# Altium project Design_Project_20231.PrjPcb
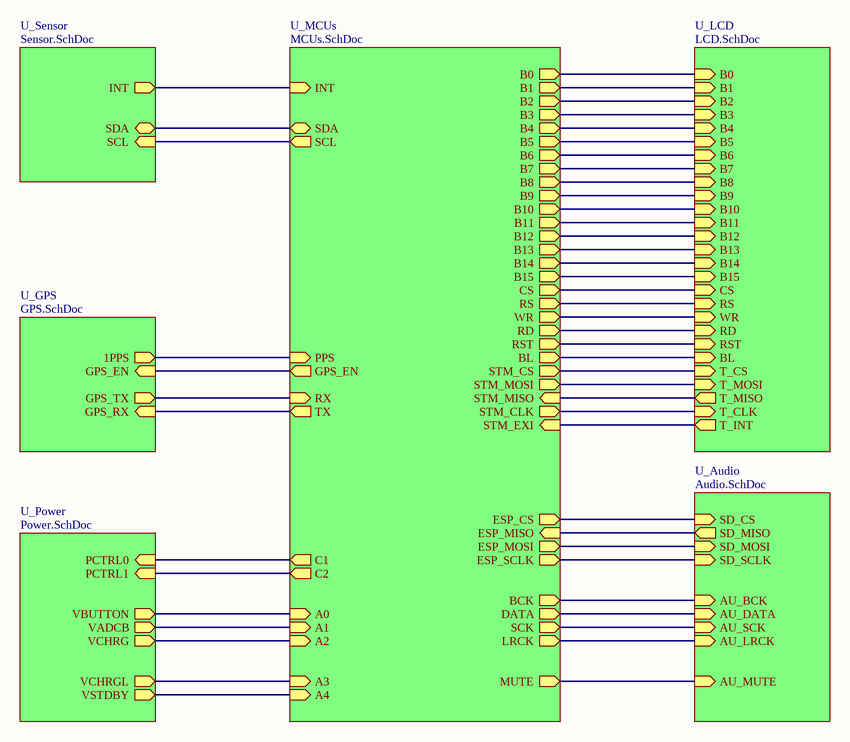
[diagram p0: Block_Diagram.SchDoc]
7 sheets, 134 parts. Net scope: hierarchical (ports join the sheet entries above them; power ports are global).
Board file: DesignProject_00.PcbDoc
Sheets:
  Block_Diagram.SchDoc
    U_MCUs = MCUs.SchDoc
    U_Audio = Audio.SchDoc
    U_GPS = GPS.SchDoc
    U_Power = Power.SchDoc
    U_Sensor = Sensor.SchDoc
    U_LCD = LCD.SchDoc

## Sheet Block_Diagram.SchDoc
size B; Organization: ORGANIZATION; Address1: ADDRESS 1; Address2: ADDRESS 2; Address3: ADDRESS 3; Address4: ADDRESS 4; Revision: -; SheetNumber: 1; SheetTotal: 7; ENG_APP_DATE: --/--/--; DSN_APP_DATE: --/--/--; CHK_APP_DATE: --/--/--

### Sub-sheets
U_Audio = Audio.SchDoc: AU_LRCK (in), SD_MISO (out), SD_CS (in), AU_DATA (in), AU_BCK (in), SD_SCLK (in), AU_SCK (in), AU_MUTE (in), SD_MOSI (in)
U_GPS = GPS.SchDoc: 1PPS (out), GPS_EN (in), GPS_TX (out), GPS_RX (in)
U_LCD = LCD.SchDoc: RST (in), B14 (in), B15 (in), RS (in), B7 (in), B9 (in), B5 (in), CS (in), T_CS (in), T_INT (out), T_MISO (out), B13 (in), B3 (in), B1 (in), T_MOSI (in), RD (in), B0 (in), B2 (in), B4 (in), B6 (in), BL (in), WR (in), B11 (in), T_CLK (in), B12 (in), B10 (in), B8 (in)
U_MCUs = MCUs.SchDoc: B11 (out), A4 (in), B8 (out), B5 (out), B7 (out), B4 (out), B10 (out), A0 (in), A2 (in), B13 (out), B1 (out), B15 (out), A1 (in), B0 (out), B6 (out), B9 (out), A3 (in), B12 (out), B14 (out), B2 (out), B3 (out), SCL (out), C1 (out), RX (in), SDA (bidir), C2 (out), TX (out), RST (out), WR (out), RD (out), CS (out), STM_EXI (in), STM_MISO (in), STM_CS (out), STM_CLK (out), STM_MOSI (out), BL (out), RS (out), PPS (in), ESP_CS (out), ESP_MOSI (out), BCK (out), LRCK (out), SCK (out), DATA (out), ESP_MISO (in), ESP_SCLK (out), INT (in), MUTE (out), GPS_EN (out)
U_Power = Power.SchDoc: VBUTTON (out), VCHRG (out), PCTRL1 (in), PCTRL0 (in), VADCB (out), VSTDBY (out), VCHRGL (out)
U_Sensor = Sensor.SchDoc: SCL (in), INT (out), SDA (bidir)

### Nets
1PPS: sheet U_MCUs/PPS, sheet U_GPS/1PPS
A0: sheet U_MCUs/A0, sheet U_Power/VBUTTON
A1: sheet U_MCUs/A1, sheet U_Power/VADCB
A2: sheet U_MCUs/A2, sheet U_Power/VCHRG
A3: sheet U_MCUs/A3, sheet U_Power/VCHRGL
A4: sheet U_MCUs/A4, sheet U_Power/VSTDBY
A5: sheet U_MCUs/STM_CLK, sheet U_LCD/T_CLK
A6: sheet U_MCUs/STM_MISO, sheet U_LCD/T_MISO
A7: sheet U_MCUs/STM_MOSI, sheet U_LCD/T_MOSI
A8: sheet U_MCUs/RD, sheet U_LCD/RD
A9: sheet U_MCUs/RST, sheet U_LCD/RST
B0: sheet U_MCUs/B0, sheet U_LCD/B0
B1: sheet U_MCUs/B1, sheet U_LCD/B1
B2: sheet U_MCUs/B2, sheet U_LCD/B2
B3: sheet U_MCUs/B3, sheet U_LCD/B3
B4: sheet U_MCUs/B4, sheet U_LCD/B4
B5: sheet U_MCUs/B5, sheet U_LCD/B5
B6: sheet U_MCUs/B6, sheet U_LCD/B6
B7: sheet U_MCUs/B7, sheet U_LCD/B7
B8: sheet U_MCUs/B8, sheet U_LCD/B8
B9: sheet U_MCUs/B9, sheet U_LCD/B9
B10: sheet U_MCUs/B10, sheet U_LCD/B10
B11: sheet U_MCUs/B11, sheet U_LCD/B11
B12: sheet U_MCUs/B12, sheet U_LCD/B12
B13: sheet U_MCUs/B13, sheet U_LCD/B13
B14: sheet U_MCUs/B14, sheet U_LCD/B14
B15: sheet U_MCUs/B15, sheet U_LCD/B15
BCK: sheet U_MCUs/BCK, sheet U_Audio/AU_BCK
C1: sheet U_MCUs/C1, sheet U_Power/PCTRL0
C2: sheet U_MCUs/C2, sheet U_Power/PCTRL1
C4: sheet U_MCUs/STM_CS, sheet U_LCD/T_CS
C5: sheet U_MCUs/STM_EXI, sheet U_LCD/T_INT
C6: sheet U_MCUs/BL, sheet U_LCD/BL
C7: sheet U_MCUs/CS, sheet U_LCD/CS
C8: sheet U_MCUs/RS, sheet U_LCD/RS
C9: sheet U_MCUs/WR, sheet U_LCD/WR
DIN: sheet U_MCUs/DATA, sheet U_Audio/AU_DATA
GPS_RX: sheet U_MCUs/TX, sheet U_GPS/GPS_RX
GPS_TX: sheet U_MCUs/RX, sheet U_GPS/GPS_TX
INT: sheet U_MCUs/INT, sheet U_Sensor/INT
LRCK: sheet U_MCUs/LRCK, sheet U_Audio/AU_LRCK
S_SCL: sheet U_MCUs/SCL, sheet U_Sensor/SCL
S_SDA: sheet U_MCUs/SDA, sheet U_Sensor/SDA
SCK: sheet U_MCUs/SCK, sheet U_Audio/AU_SCK
SD_CS: sheet U_MCUs/ESP_CS, sheet U_Audio/SD_CS
SD_MISO: sheet U_MCUs/ESP_MISO, sheet U_Audio/SD_MISO
SD_MOSI: sheet U_MCUs/ESP_MOSI, sheet U_Audio/SD_MOSI
SD_SCLK: sheet U_MCUs/ESP_SCLK, sheet U_Audio/SD_SCLK
XSMT: sheet U_MCUs/MUTE, sheet U_Audio/AU_MUTE
NetIC1_26: sheet U_MCUs/GPS_EN, sheet U_GPS/GPS_EN

### Notes on the sheet
- DWG. NO.
- REV.
- SHT.
- THIS DOCUMENT AND THE DATA DISCLOSED HEREIN OR HEREWITH IS THE PROPERTY OF ALTIUM LIMITED AND MAY BE FREELY DISTRIBUTED IN WHOLE. NO RIGHTS ARE RESERVED OR EXPRESS OR IMPLIED WARANTEE GIVEN.
- REVISION
- DESCRIPTION
- DATE
- APPROVED
- ENG:
- APPROVALS
- PROJECT
- DSN:
- CHK:
- REFERENCE DOCUMENTS
- PROJECT REVISION:
- TITLE
- DOCUMENT REVISION:
- DESIGN ITEM:
- BOM:
- FAB DWG:
- PCB DWG:
- ASSY DWG:
- SCALE:
- SIZE
- B
- CAGE CODE
- FILE NAME
- DWG NO.
- SHEET
- OF
- REV

## Sheet MCUs.SchDoc
size B; Organization: ORGANIZATION; Address1: ADDRESS 1; Address2: ADDRESS 2; Address3: ADDRESS 3; Address4: ADDRESS 4; Revision: -; SheetNumber: 2; SheetTotal: 7; ENG_APP_DATE: --/--/--; DSN_APP_DATE: --/--/--; CHK_APP_DATE: --/--/--
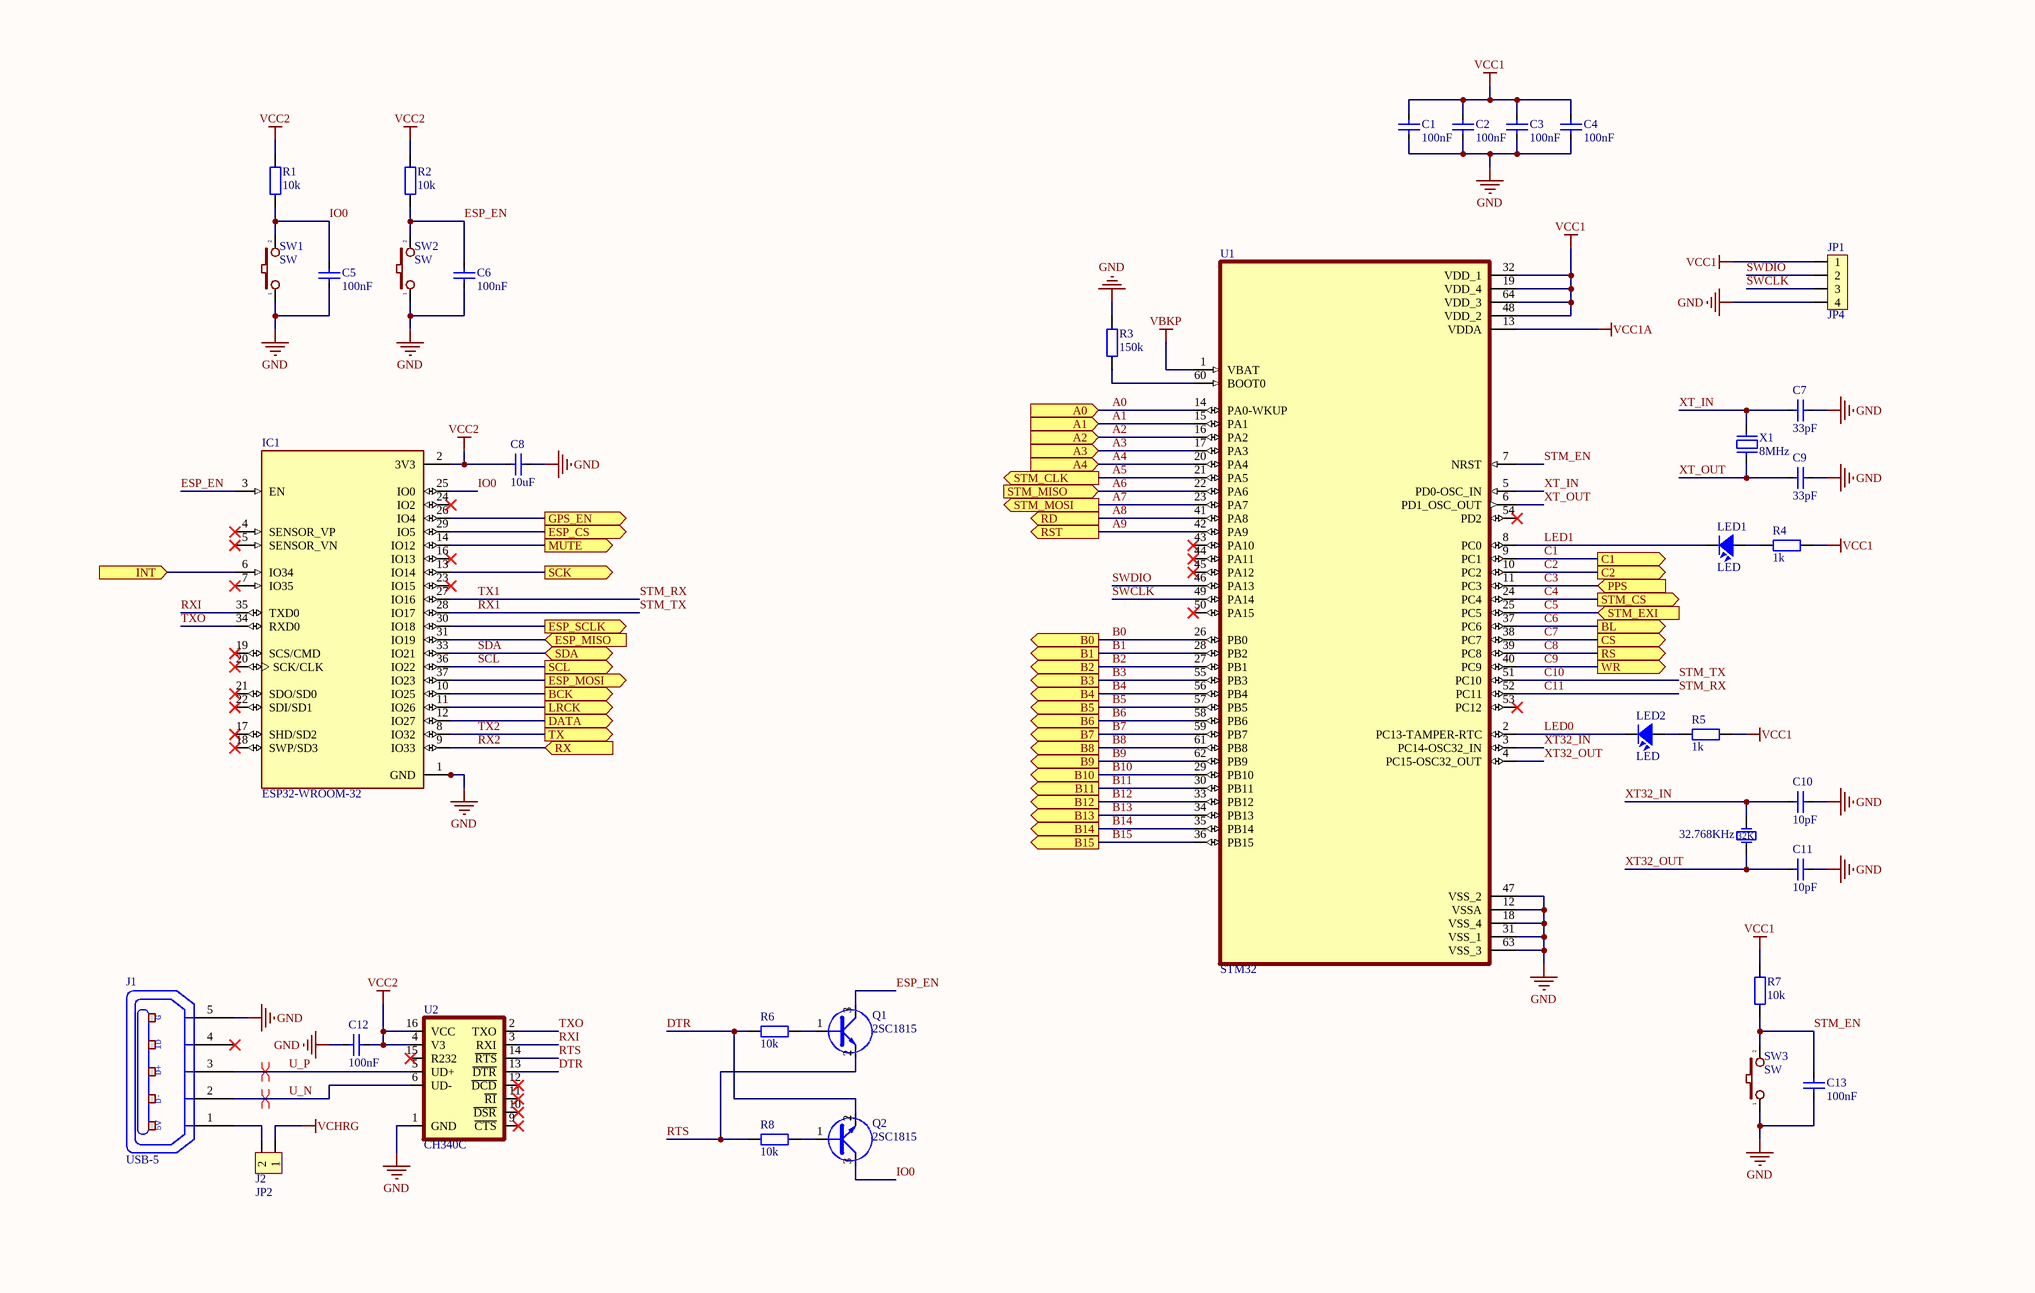
[diagram p1: MCUs.SchDoc]

### Parts
C1  100nF  [CAP_0603]
C2  100nF  [CAP_0603]
C3  100nF  [CAP_0603]
C4  100nF  [CAP_0603]
C5  100nF  [CAP_0603]
C6  100nF  [CAP_0603]
C7  33pF  [CAP_0603]
C8  10uF  [CAP_0603]
C9  33pF  [CAP_0603]
C10  10pF  [CAP_0603]
C11  10pF  [CAP_0603]
C12  100nF  [CAP_0603]
C13  100nF  [CAP_0603]
IC1  ESP32-WROOM-32  [MODULE_ESP32-WROOM-32]
J1  USB-5  [USB-M1]
J2  JP2  [JP2-CLOSED]
JP1  JP4  [JP4-C1T]
LED1  LED  [LED-0805-Red]
LED2  LED  [LED-0805-Red]
Q1  2SC1815  [SOT23D]
Q2  2SC1815  [SOT23D]
R1  10k  [RES-SMD-0603]
R2  10k  [RES-SMD-0603]
R3  150k  [RES-SMD-0603]
R4  1k  [RES-SMD-0603]
R5  1k  [RES-SMD-0603]
R6  10k  [RES-SMD-0603]
R7  10k  [RES-SMD-0603]
R8  10k  [RES-SMD-0603]
SW1  SW  [SW 3x2x4]
SW2  SW  [SW 3x2x4]
SW3  SW  [SW 3x2x4]
U1  STM32  [LQFP 64]
U2  CH340C  [SOP-16]
X1  8MHz  [XT2]
Y1  32.768KHz  [XTAL32K]

### Ports
A0 (in), A1 (in), A2 (in), A3 (in), A4 (in), B0 (out), B1 (out), B2 (out), B3 (out), B4 (out), B5 (out), B6 (out), B7 (out), B8 (out), B9 (out), B10 (out), B11 (out), B12 (out), B13 (out), B14 (out), B15 (out), BCK (out), BL (out), C1 (out), C2 (out), CS (out), DATA (out), ESP_CS (out), ESP_MISO (in), ESP_MOSI (out), ESP_SCLK (out), GPS_EN (out), INT (in), LRCK (out), MUTE (out), PPS (in), RD (out), RS (out), RST (out), RX (in), SCK (out), SCL (out), SDA (bidir), STM_CLK (out), STM_CS (out), STM_EXI (in), STM_MISO (in), STM_MOSI (out), TX (out), WR (out)

### Nets
GND: C1.2 C2.2 C3.2 C4.2 C5.2 C6.2 C7.1 C8.2 C9.1 C10.1 C11.1 C12.1 C13.2 IC1.1(GND) IC1.15(GND) IC1.38(GND) IC1.39_1(GND) IC1.39_2(GND) IC1.39_3(GND) IC1.39_4(GND) IC1.39_5(GND) IC1.39_6(GND) IC1.39_7(GND) IC1.39_8(GND) IC1.39_9(GND) IC1.39_10(GND) IC1.39_11(GND) IC1.39_12(GND) IC1.39_13(GND) IC1.39_14(GND) IC1.39_15(GND) IC1.39_16(GND) IC1.39_17(GND) IC1.39_18(GND) IC1.39_19(GND) IC1.39_20(GND) IC1.39_21(GND) J1.5(P5) JP1.4 R3.1 SW1.1 SW2.1 SW3.1 U1.12(VSSA) U1.18(VSS_4) U1.31(VSS_1) U1.47(VSS_2) U1.63(VSS_3) U2.1(GND)
VBKP: U1.1(VBAT)
VCC1: C1.1 C2.1 C3.1 C4.1 JP1.1 R4.1 R5.1 R7.2 U1.19(VDD_4) U1.32(VDD_1) U1.48(VDD_2) U1.64(VDD_3)
VCC1A: U1.13(VDDA)
VCC2: C8.1 C12.2 IC1.2(3V3) R1.2 R2.2 U2.4(V3) U2.16(VCC)
VCHRG: J2.1
A0: U1.14(PA0-WKUP) ; port A0
A1: U1.15(PA1) ; port A1
A2: U1.16(PA2) ; port A2
A3: U1.17(PA3) ; port A3
A4: U1.20(PA4) ; port A4
A5: U1.21(PA5) ; port STM_CLK
A6: U1.22(PA6) ; port STM_MISO
A7: U1.23(PA7) ; port STM_MOSI
A8: U1.41(PA8) ; port RD
A9: U1.42(PA9) ; port RST
B0: U1.26(PB0) ; port B0
B1: U1.28(PB2) ; port B1
B2: U1.27(PB1) ; port B2
B3: U1.55(PB3) ; port B3
B4: U1.56(PB4) ; port B4
B5: U1.57(PB5) ; port B5
B6: U1.58(PB6) ; port B6
B7: U1.59(PB7) ; port B7
B8: U1.61(PB8) ; port B8
B9: U1.62(PB9) ; port B9
B10: U1.29(PB10) ; port B10
B11: U1.30(PB11) ; port B11
B12: U1.33(PB12) ; port B12
B13: U1.34(PB13) ; port B13
B14: U1.35(PB14) ; port B14
B15: U1.36(PB15) ; port B15
BCK: IC1.10(IO25) ; port BCK
C1: U1.9(PC1) ; port C1
C2: U1.10(PC2) ; port C2
C3: U1.11(PC3) ; port PPS  [project net 1PPS]
C4: U1.24(PC4) ; port STM_CS
C5: U1.25(PC5) ; port STM_EXI
C6: U1.37(PC6) ; port BL
C7: U1.38(PC7) ; port CS
C8: U1.39(PC8) ; port RS
C9: U1.40(PC9) ; port WR
C10: IC1.28(IO17) U1.51(PC10)  [also labelled RX1, STM_TX]
C11: IC1.27(IO16) U1.52(PC11)  [also labelled STM_RX, TX1]
DIN: IC1.12(IO27) ; port DATA
DTR: Q2.2(E) R6.2 U2.13(~{DTR})
ESP_EN: C6.1 IC1.3(EN) Q1.3(C) R2.1 SW2.2
INT: IC1.6(IO34) ; port INT
IO0: C5.1 IC1.25(IO0) Q2.3(C) R1.1 SW1.2
LED0: LED2.2 U1.2(PC13-TAMPER-RTC)
LED1: LED1.2 U1.8(PC0)
LRCK: IC1.11(IO26) ; port LRCK
RTS: Q1.2(E) R8.2 U2.14(~{RTS})
RX2: IC1.9(IO33) ; port RX  [project net GPS_TX]
RXI: IC1.35(TXD0) U2.3(RXI)
SCK: IC1.13(IO14) ; port SCK
SCL: IC1.36(IO22) ; port SCL  [project net S_SCL]
SD_CS: IC1.29(IO5) ; port ESP_CS
SD_MISO: IC1.31(IO19) ; port ESP_MISO
SD_MOSI: IC1.37(IO23) ; port ESP_MOSI
SD_SCLK: IC1.30(IO18) ; port ESP_SCLK
SDA: IC1.33(IO21) ; port SDA  [project net S_SDA]
STM_EN: C13.1 R7.1 SW3.2 U1.7(NRST)
SWCLK: JP1.3 U1.49(PA14)
SWDIO: JP1.2 U1.46(PA13)
TX2: IC1.8(IO32) ; port TX  [project net GPS_RX]
TXO: IC1.34(RXD0) U2.2(TXO)
U_N: J1.2(P2) U2.6(UD-)
U_P: J1.3(P3) U2.5(UD+)
XSMT: IC1.14(IO12) ; port MUTE
XT32_IN: C10.2 U1.3(PC14-OSC32_IN) Y1.1(OSC1)
XT32_OUT: C11.2 U1.4(PC15-OSC32_OUT) Y1.2(OSC2)
XT_IN: C7.2 U1.5(PD0-OSC_IN) X1.2
XT_OUT: C9.2 U1.6(PD1_OSC_OUT) X1.1
NetIC1_26: IC1.26(IO4) ; port GPS_EN
NetJ1_1: J1.1(P1) J2.2
NetLED1_1: LED1.1 R4.2
NetLED2_1: LED2.1 R5.2
NetQ1_1: Q1.1(B) R6.1
NetQ2_1: Q2.1(B) R8.1
NetR3_2: R3.2 U1.60(BOOT0)

Not connected (* = marked no-connect by the designer): IC1 4(SENSOR_VP)* 5(SENSOR_VN)* 7(IO35)* 16(IO13)* 17(SHD/SD2)* 18(SWP/SD3)* 19(SCS/CMD)* 20(SCK/CLK)* 21(SDO/SD0)* 22(SDI/SD1)* 23(IO15)* 24(IO2)*; J1 4(P4)*; U1 43(PA10)* 44(PA11)* 45(PA12)* 50(PA15)* 53(PC12)* 54(PD2)*; U2 9(~{CTS})* 10(~{DSR})* 11(~{RI})* 12(~{DCD})* 15(R232)*

### Layout directives
differential pair: U_N, U_P

### Notes on the sheet
- DWG. NO.
- REV.
- SHT.
- THIS DOCUMENT AND THE DATA DISCLOSED HEREIN OR HEREWITH IS THE PROPERTY OF ALTIUM LIMITED AND MAY BE FREELY DISTRIBUTED IN WHOLE. NO RIGHTS ARE RESERVED OR EXPRESS OR IMPLIED WARANTEE GIVEN.
- REVISION
- DESCRIPTION
- DATE
- APPROVED
- ENG:
- APPROVALS
- PROJECT
- DSN:
- CHK:
- REFERENCE DOCUMENTS
- PROJECT REVISION:
- TITLE
- DOCUMENT REVISION:
- DESIGN ITEM:
- BOM:
- FAB DWG:
- PCB DWG:
- ASSY DWG:
- SCALE:
- SIZE
- B
- CAGE CODE
- FILE NAME
- DWG NO.
- SHEET
- OF
- REV
- (in symbol USB-5) G; ID; D+; D-; 5V
- (in symbol XTAL/32KHz) 32K

### Library data of the parts
C1-C13 = CapSMD: Capacitor; Value: 33p; Published: 8-Jun-2000; LatestRevisionDate: 17-Jul-2002; LatestRevisionNote: Re-released for DXP Platform.; PackageReference: RAD-0.3; Publisher: Altium Limited
IC1 = ESP32-WROOM-32: Bluetooth, WiFi Transceiver Module 2.4GHz ~ 2.5GHz Surface Mount; MF: Espressif Systems; Package: Module Espressif Systems; Digi-Key_Part_Number: 1904-1010-1-ND; Digi-Key_Purchase_URL: https://www.digikey.com/product-detail/en/espressif-systems/ESP32-WROOM-32/1904-1010-1-ND/8544305?utm_source=snapeda&utm_medium=aggregator&utm_campaign=symbol; Value: *; MP: ESP32-WROOM-32; SnapEDA_Link: https://www.snapeda.com/parts/ESP32-WROOM-32/Espressif%20Systems/view-part/2753322/?ref=snap
J1 = USB-5: Manufacturer: FCI; Manufacturer Part Number: 10118193-0001LF; Connector Type: USB - micro B; Number of Contacts: 5; Gender: Receptacle; Specifications: USB 2.0; .Creator: MM; .Checked PCB: RF; Supplier 1: Digi-Key; RoHS: RoHS Compliant; Category: Connectors, Interconnects; Stock 1: 28642; Pricing 1: 1=0.46, 10=0.433, 25=0.3712, 50=0.3156, 100=0.3032, 250=0.27224, 500=0.25988 (USD); Packaging: Cut Tape (CT); Mounting Type: Surface Mount, Right Angle, Horizontal; Features: Shielded, Solder Retention; Ingress Protection: -; ComponentLink1URL: http://portal.fciconnect.com/Comergent//fci/drawing/10118193.pdf; ComponentLink1Description: http://portal.fciconnect.com/Comergent//fci/drawing/10118193.pdf; Supplier Part Number 1: 609-4616-1-ND; .Checked SCH: MM
J2 = JP2: WR-PHD 2.54 mm Angled Socket Header; Manufacturer: W¨¹rth Elektronik eiSos GmbH; partNo: 613002143121; ComponentLink1 Description: Manufacturer; ComponentLink2 Description: Datasheet; NoPins: 02; Created Date: 29 March 2013; ComponentLink1URL: http://www.we-online.com; ComponentLink2URL: http://katalog.we-online.de/em/datasheet/6130xx143121.pdf; Created by: Karrer Zheng
JP1 = JP4: WR-PHD 2.54 mm Angled Socket Header; Manufacturer: W¨¹rth Elektronik eiSos GmbH; partNo: 613004143121; ComponentLink1 Description: Manufacturer; ComponentLink2 Description: Datasheet; NoPins: 04; Created Date: 29 March 2013; ComponentLink1URL: http://www.we-online.com; ComponentLink2URL: http://katalog.we-online.de/em/datasheet/6130xx143121.pdf; Created by: Karrer Zheng
LED1 LED2 = LED: LED Single colour Green and Red; Value: LED 3 ly Single Colour
Q1 Q2 = C1815: NPN 600mW, ECB; Value: C1815
R1-R8 = Resistor - SMD: Resistor SMD; Manufacturer: Generic Components; Class: Passive; Published: 08/06/2000; Publisher: Altium Hobart Technology Centre
SW1-SW3 = SW2: Switch button 2 pin; Value: SW chip 2 pin
U1 = STM32F103RCT6: STM32 ARM-based 32-bit MCU 72MHz 256KB
U2 = CH340C: USB to serial chip CH340; MF: WCH; Package: Package; Check_prices: https://www.snapeda.com/parts/CH340C/WCH/view-part/5428851/?ref=eda; Value: *; Price: None; MP: CH340C; Availability: Unavailable; SnapEDA_Link: https://www.snapeda.com/parts/CH340C/WCH/view-part/5428851/?ref=snap
X1 = XT2: Crystal For all Crystal 2pin.; Value: 4Mhz
Y1 = XTAL/32KHz: Crystal Oscillator; Published: 8-Jun-2000; LatestRevisionDate: 17-Jul-2002; LatestRevisionNote: Re-released for DXP Platform.; PackageReference: R38; Publisher: Altium Limited

## Sheet Audio.SchDoc
size B; Organization: ORGANIZATION; Address1: ADDRESS 1; Address2: ADDRESS 2; Address3: ADDRESS 3; Address4: ADDRESS 4; Revision: -; SheetNumber: 4; SheetTotal: 7; ENG_APP_DATE: --/--/--; DSN_APP_DATE: --/--/--; CHK_APP_DATE: --/--/--
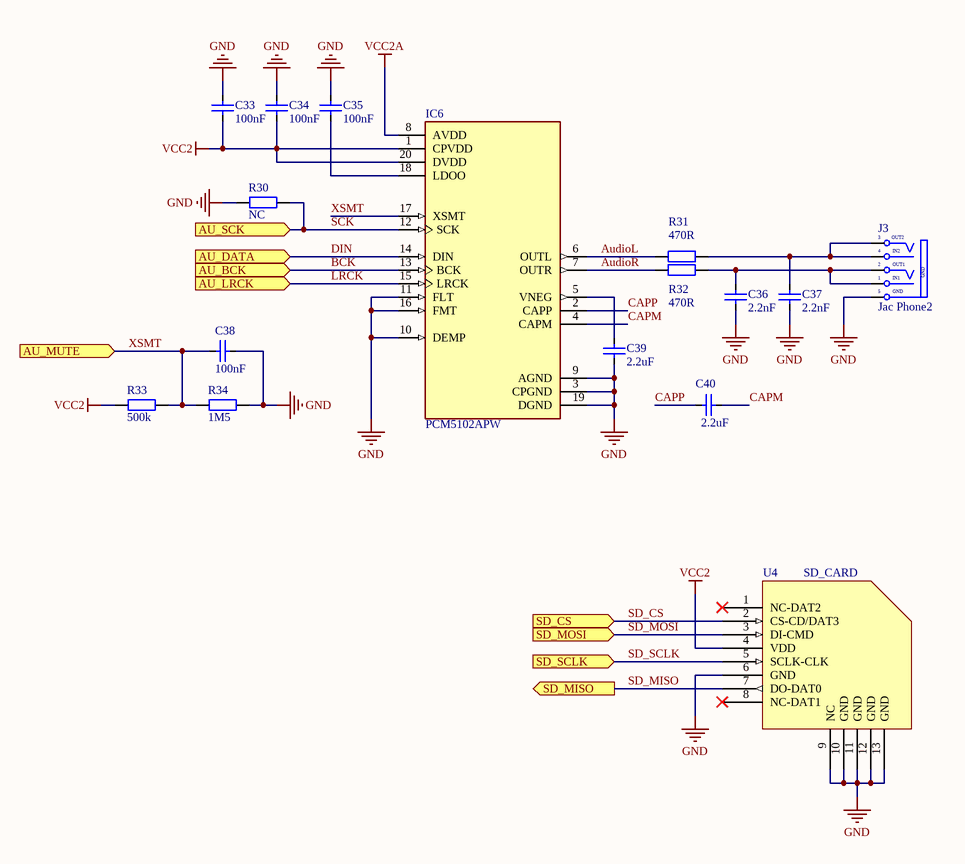
[diagram p2: Audio.SchDoc]

### Parts
C33  100nF  [CAP_0603]
C34  100nF  [CAP_0603]
C35  100nF  [CAP_0603]
C36  2.2nF  [CAP_0603]
C37  2.2nF  [CAP_0603]
C38  100nF  [CAP_0603]
C39  2.2uF  [CAP_0603]
C40  2.2uF  [CAP_0603]
IC6  PCM5102APW  [TSSOP-20]
J3  Jac Phone2  [JacPhone2]
R30  NC  [RES-SMD-0603]
R31  470R  [RES-SMD-0603]
R32  470R  [RES-SMD-0603]
R33  500k  [RES-SMD-0603]
R34  1M5  [RES-SMD-0603]
U4  SD_CARD  [MICROSD2]

### Ports
AU_BCK (in), AU_DATA (in), AU_LRCK (in), AU_MUTE (in), AU_SCK (in), SD_CS (in), SD_MISO (out), SD_MOSI (in), SD_SCLK (in)

### Nets
GND: C33.1 C34.1 C35.1 C36.1 C37.1 C38.2 C39.1 IC6.3(CPGND) IC6.9(AGND) IC6.10(DEMP) IC6.11(FLT) IC6.16(FMT) IC6.19(DGND) J3.5(GND) R30.1 R34.2 U4.6(GND) U4.9(NC) U4.10(GND) U4.11(GND) U4.12(GND) U4.13(GND)
VCC2: C33.2 C34.2 IC6.1(CPVDD) IC6.20(DVDD) R33.1 U4.4(VDD)
VCC2A: IC6.8(AVDD)
AudioL: IC6.6(OUTL) R31.2
AudioR: IC6.7(OUTR) R32.2
BCK: IC6.13(BCK) ; port AU_BCK
CAPM: C40.2 IC6.4(CAPM)
CAPP: C40.1 IC6.2(CAPP)
DIN: IC6.14(DIN) ; port AU_DATA
LRCK: IC6.15(LRCK) ; port AU_LRCK
SCK: IC6.12(SCK) R30.2 ; port AU_SCK
SD_CS: U4.2(CS-CD/DAT3) ; port SD_CS
SD_MISO: U4.7(DO-DAT0) ; port SD_MISO
SD_MOSI: U4.3(DI-CMD) ; port SD_MOSI
SD_SCLK: U4.5(SCLK-CLK) ; port SD_SCLK
XSMT: C38.1 IC6.17(XSMT) R33.2 R34.1 ; port AU_MUTE
NetC35_2: C35.2 IC6.18(LDOO)
NetC36_2: C36.2 J3.1(S1) J3.2(S1) R32.1
NetC37_2: C37.2 J3.3(TN) J3.4(S) R31.1
NetC39_2: C39.2 IC6.5(VNEG)

Not connected (* = marked no-connect by the designer): U4 1(NC-DAT2)* 8(NC-DAT1)*

### Notes on the sheet
- DWG. NO.
- REV.
- SHT.
- THIS DOCUMENT AND THE DATA DISCLOSED HEREIN OR HEREWITH IS THE PROPERTY OF ALTIUM LIMITED AND MAY BE FREELY DISTRIBUTED IN WHOLE. NO RIGHTS ARE RESERVED OR EXPRESS OR IMPLIED WARANTEE GIVEN.
- REVISION
- DESCRIPTION
- DATE
- APPROVED
- ENG:
- APPROVALS
- PROJECT
- DSN:
- CHK:
- REFERENCE DOCUMENTS
- PROJECT REVISION:
- TITLE
- DOCUMENT REVISION:
- DESIGN ITEM:
- BOM:
- FAB DWG:
- PCB DWG:
- ASSY DWG:
- SCALE:
- SIZE
- B
- CAGE CODE
- FILE NAME
- DWG NO.
- SHEET
- OF
- REV
- (in symbol Jac Phone2) OUT2; IN2; OUT1; IN1

### Library data of the parts
C33-C40 = CapSMD: Capacitor; Value: 33p; Published: 8-Jun-2000; LatestRevisionDate: 17-Jul-2002; LatestRevisionNote: Re-released for DXP Platform.; PackageReference: RAD-0.3; Publisher: Altium Limited
IC6 = PCM5102APW: Audio decode
J3 = Jac Phone2: Jac Phone Stereo; Creat by: VanDungEvn@Gmail.com
R30-R34 = Resistor - SMD: as R1 on sheet MCUs; Published: 08/06/2000; Publisher: Altium Hobart Technology Centre
U4 = MicroSD: SD/MMC holder; Name: SD/MMC; Price: 10000

## Sheet GPS.SchDoc
size B; Organization: ORGANIZATION; Address1: ADDRESS 1; Address2: ADDRESS 2; Address3: ADDRESS 3; Address4: ADDRESS 4; Revision: -; SheetNumber: 6; SheetTotal: 7; ENG_APP_DATE: --/--/--; DSN_APP_DATE: --/--/--; CHK_APP_DATE: --/--/--
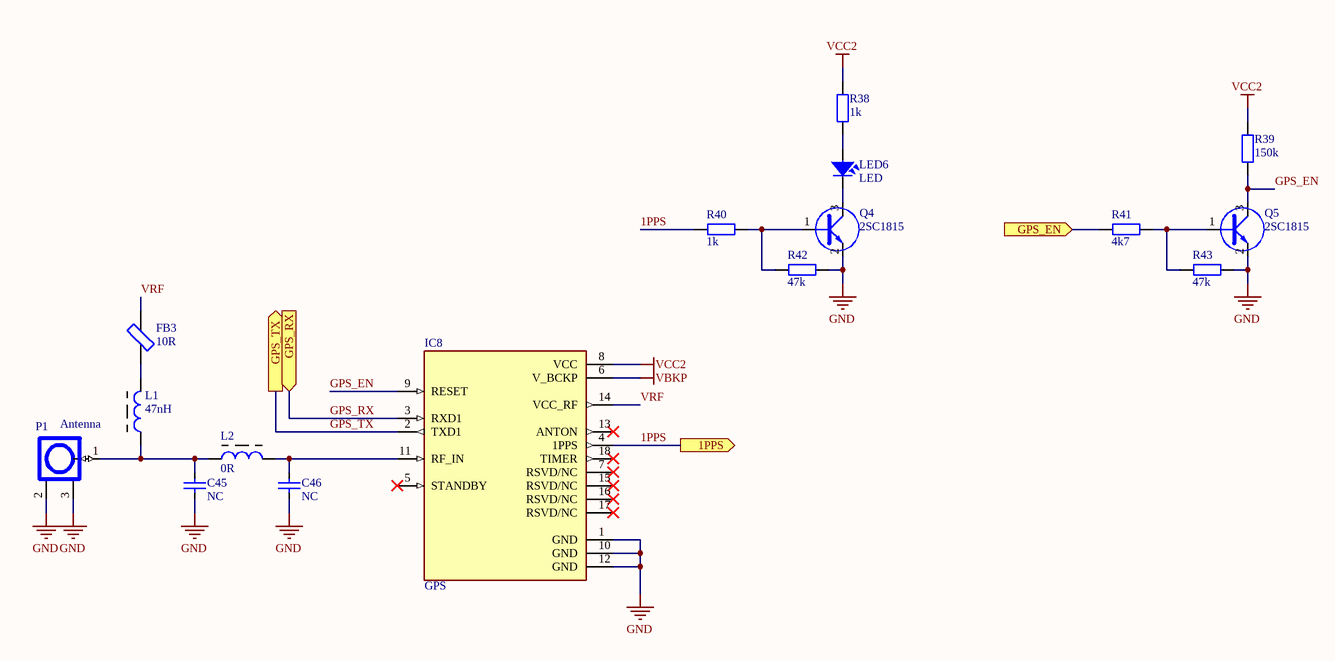
[diagram p3: GPS.SchDoc]

### Parts
C45  NC  [CAP_0805]
C46  NC  [CAP_0805]
FB3  10R  [RES-SMD-0805]
IC8  GPS  [L70]
L1  47nH  [L-0805]
L2  0R  [L-0805]
LED6  LED  [LED-0805-Red]
P1  Antenna  [IPXS]
Q4  2SC1815  [SOT23D]
Q5  2SC1815  [SOT23D]
R38  1k  [RES-SMD-0603]
R39  150k  [RES-SMD-0603]
R40  1k  [RES-SMD-0603]
R41  4k7  [RES-SMD-0603]
R42  47k  [RES-SMD-0603]
R43  47k  [RES-SMD-0603]

### Ports
1PPS (out), GPS_EN (in), GPS_RX (in), GPS_TX (out)

### Nets
GND: C45.1 C46.1 IC8.1(GND) IC8.10(GND) IC8.12(GND) P1.2 P1.3 Q4.2(E) Q5.2(E) R42.1 R43.1
VBKP: IC8.6(V_BCKP)
VCC2: IC8.8(VCC) R38.1 R39.1
1PPS: IC8.4(1PPS) R40.2 ; port 1PPS
GPS_EN: IC8.9(RESET) Q5.3(C) R39.2
GPS_RX: IC8.3(RXD1) ; port GPS_RX
GPS_TX: IC8.2(TXD1) ; port GPS_TX
VRF: FB3.2 IC8.14(VCC_RF)
NetC45_2: C45.2 L1.1 L2.1 P1.1
NetC46_2: C46.2 IC8.11(RF_IN) L2.2
NetFB3_1: FB3.1 L1.2
NetIC1_26: R41.2 ; port GPS_EN
NetLED6_1: LED6.1 R38.2
NetLED6_2: LED6.2 Q4.3(C)
NetQ4_1: Q4.1(B) R40.1 R42.2
NetQ5_1: Q5.1(B) R41.1 R43.2

Not connected (* = marked no-connect by the designer): IC8 5(STANDBY)* 7(RSVD/NC)* 13(ANTON)* 15(RSVD/NC)* 16(RSVD/NC)* 17(RSVD/NC)* 18(TIMER)*

### Notes on the sheet
- DWG. NO.
- REV.
- SHT.
- THIS DOCUMENT AND THE DATA DISCLOSED HEREIN OR HEREWITH IS THE PROPERTY OF ALTIUM LIMITED AND MAY BE FREELY DISTRIBUTED IN WHOLE. NO RIGHTS ARE RESERVED OR EXPRESS OR IMPLIED WARANTEE GIVEN.
- REVISION
- DESCRIPTION
- DATE
- APPROVED
- ENG:
- APPROVALS
- PROJECT
- DSN:
- CHK:
- REFERENCE DOCUMENTS
- PROJECT REVISION:
- TITLE
- DOCUMENT REVISION:
- DESIGN ITEM:
- BOM:
- FAB DWG:
- PCB DWG:
- ASSY DWG:
- SCALE:
- SIZE
- B
- CAGE CODE
- FILE NAME
- DWG NO.
- SHEET
- OF
- REV

### Library data of the parts
C45 C46 = CapSMD: Capacitor; Value: 33p; Published: 8-Jun-2000; LatestRevisionDate: 17-Jul-2002; LatestRevisionNote: Re-released for DXP Platform.; PackageReference: RAD-0.3; Publisher: Altium Limited
FB3 = Ferrit Bead: Generic Ferrit Bead
IC8 = L70: Quectel GPS IC
L1 L2 = Inductor Ferit: Inductor; Value: 150 mH
LED6 = LED: as LED1 on sheet MCUs
P1 = IPXSx66: Antenna GSM GPS
Q4 Q5 = C1815: NPN 600mW, ECB; Value: C1815
R38-R43 = Resistor - SMD: as R1 on sheet MCUs; Published: 08/06/2000; Publisher: Altium Hobart Technology Centre

## Sheet Power.SchDoc
size B; Organization: ORGANIZATION; Address1: ADDRESS 1; Address2: ADDRESS 2; Address3: ADDRESS 3; Address4: ADDRESS 4; Revision: -; SheetNumber: 3; SheetTotal: 7; ENG_APP_DATE: --/--/--; DSN_APP_DATE: --/--/--; CHK_APP_DATE: --/--/--
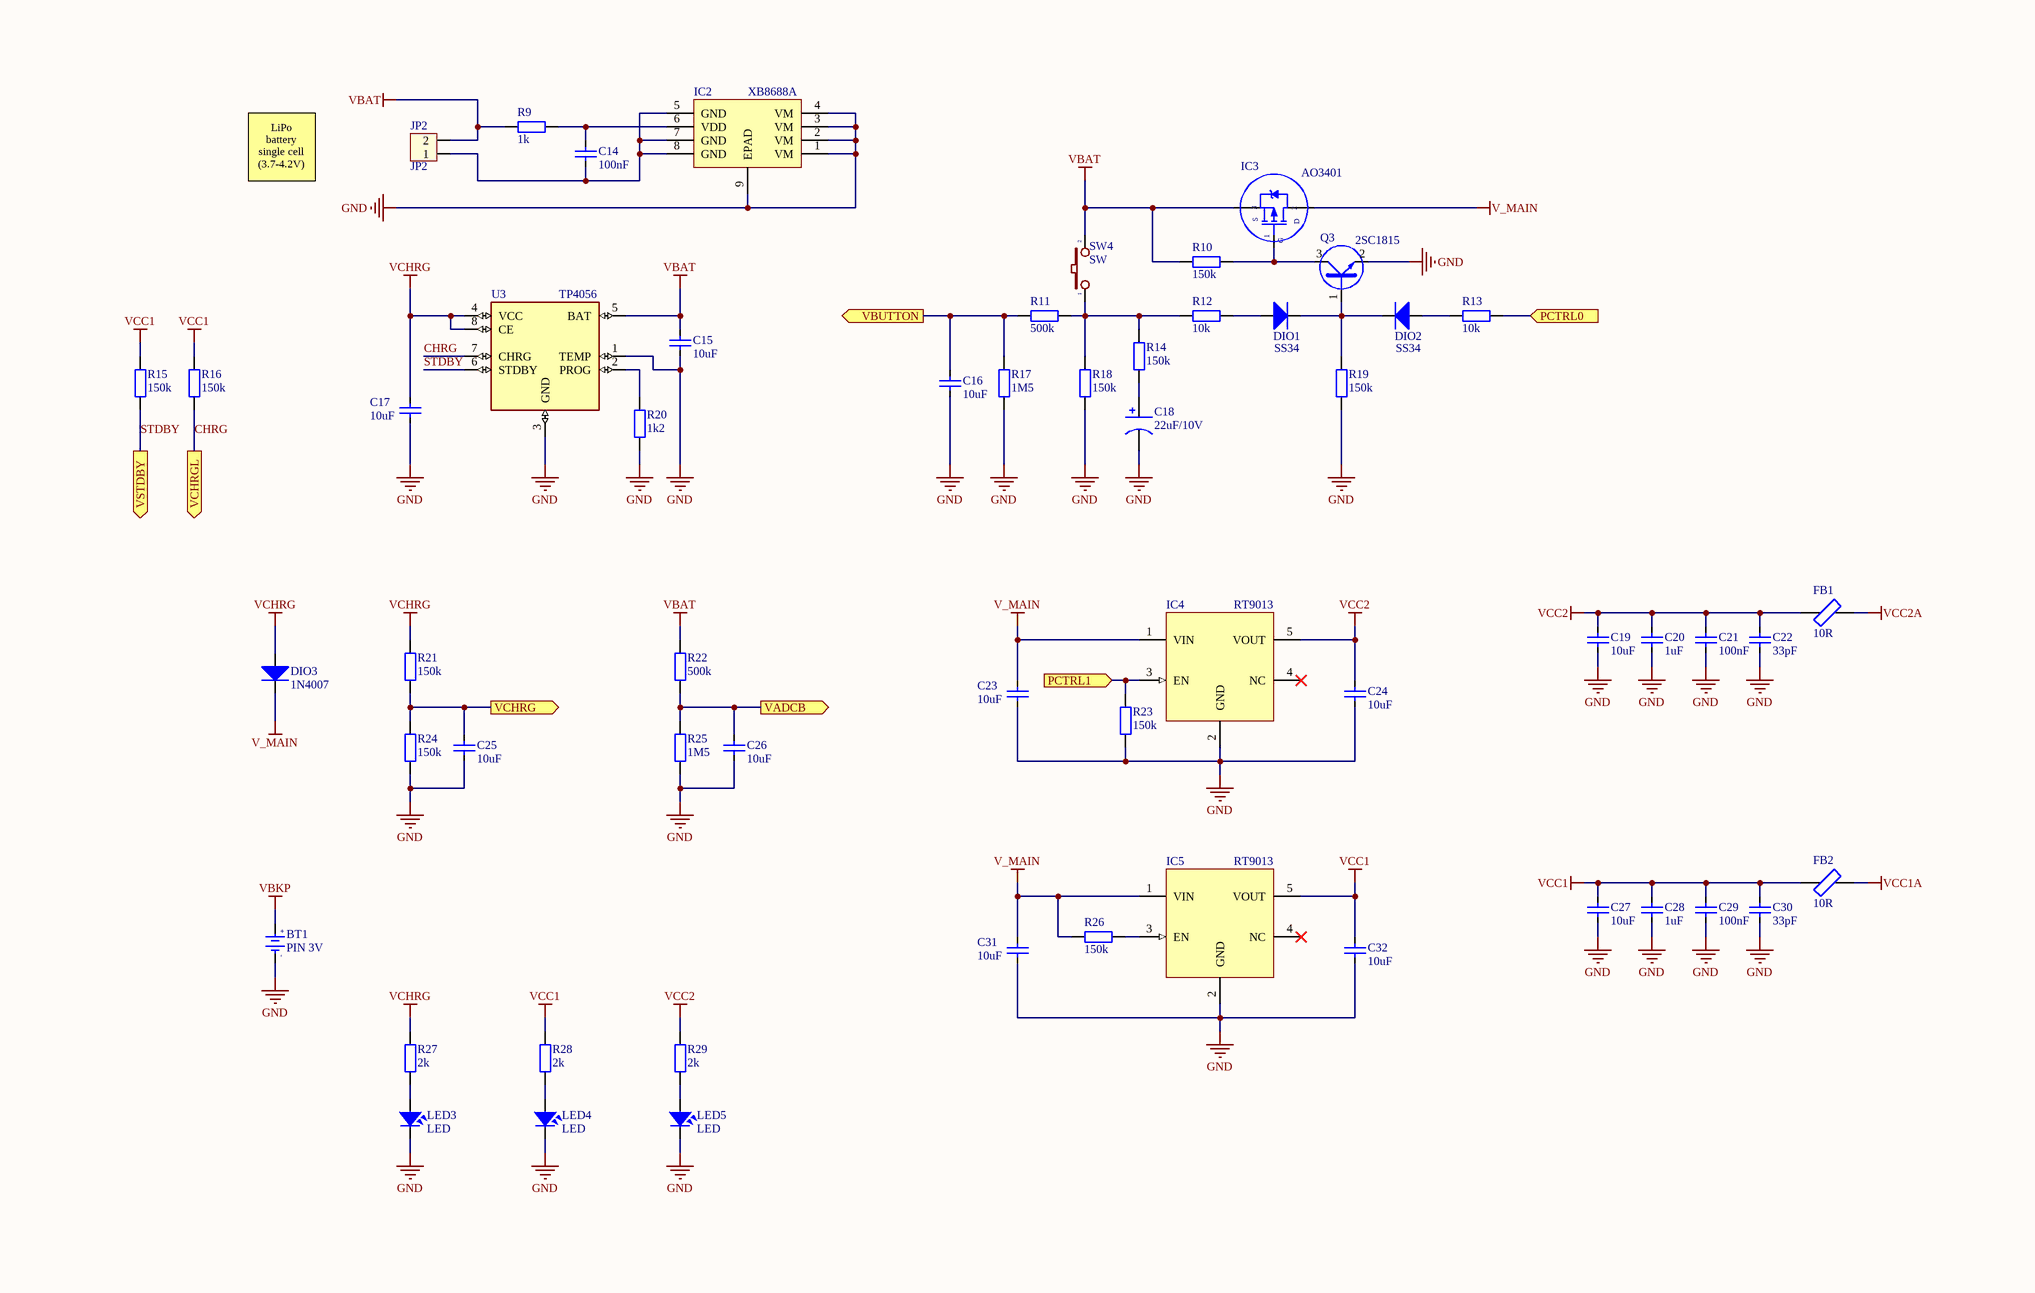
[diagram p4: Power.SchDoc]

### Parts
BT1  PIN 3V  [CR1220 SMD]
C14  100nF  [CAP_0603]
C15  10uF  [CAP_0603]
C16  10uF  [CAP_0603]
C17  10uF  [CAP_0603]
C18  22uF/10V  [C3MM]
C19  10uF  [CAP_0603]
C20  1uF  [CAP_0603]
C21  100nF  [CAP_0603]
C22  33pF  [CAP_0603]
C23  10uF  [CAP_0603]
C24  10uF  [CAP_0603]
C25  10uF  [CAP_0603]
C26  10uF  [CAP_0603]
C27  10uF  [CAP_0603]
C28  1uF  [CAP_0603]
C29  100nF  [CAP_0603]
C30  33pF  [CAP_0603]
C31  10uF  [CAP_0603]
C32  10uF  [CAP_0603]
DIO1  SS34  [DIO-214AC(SMA)]
DIO2  SS34  [DIO-214AC(SMA)]
DIO3  1N4007  [DIO-214AC(SMA)]
FB1  10R  [RES-SMD-0805]
FB2  10R  [RES-SMD-0805]
IC2  XB8688A  [SOP8-PP]
IC3  AO3401  [SOT23A]
IC4  RT9013  [SOT23-5]
IC5  RT9013  [SOT23-5]
JP2  JP2  [CON2]
LED3  LED  [LED-0805-Red]
LED4  LED  [LED-0805-Red]
LED5  LED  [LED-0805-Red]
Q3  2SC1815  [SOT23D]
R9  1k  [RES-SMD-0603]
R10  150k  [RES-SMD-0603]
R11  500k  [RES-SMD-0603]
R12  10k  [RES-SMD-0603]
R13  10k  [RES-SMD-0603]
R14  150k  [RES-SMD-0603]
R15  150k  [RES-SMD-0603]
R16  150k  [RES-SMD-0603]
R17  1M5  [RES-SMD-0603]
R18  150k  [RES-SMD-0603]
R19  150k  [RES-SMD-0603]
R20  1k2  [RES-SMD-0603]
R21  150k  [RES-SMD-0603]
R22  500k  [RES-SMD-0603]
R23  150k  [RES-SMD-0603]
R24  150k  [RES-SMD-0603]
R25  1M5  [RES-SMD-0603]
R26  150k  [RES-SMD-0603]
R27  2k  [RES-SMD-0603]
R28  2k  [RES-SMD-0603]
R29  2k  [RES-SMD-0603]
SW4  SW  [SW2-D2]
U3  TP4056  [TP4056]

### Ports
PCTRL0 (in), PCTRL1 (in), VADCB (out), VBUTTON (out), VCHRG (out), VCHRGL (out), VSTDBY (out)

### Nets
GND: BT1.2(GND) C15.1 C16.1 C17.1 C18.2 C19.1 C20.1 C21.1 C22.1 C23.1 C24.1 C25.1 C26.1 C27.1 C28.1 C29.1 C30.1 C31.1 C32.1 IC2.1(VM) IC2.2(VM) IC2.3(VM) IC2.4(VM) IC2.9(EPAD) IC4.2(GND) IC5.2(GND) LED3.2 LED4.2 LED5.2 Q3.2(E) R17.1 R18.2 R19.2 R20.1 R23.1 R24.2 R25.1 U3.1(TEMP) U3.3(GND)
V_MAIN: C23.2 C31.2 DIO3.2(K) IC3.2(D) IC4.1(VIN) IC5.1(VIN) R26.1
VBAT: C15.2 IC3.3(S) JP2.2 R9.1 R10.1 R22.2 SW4.2 U3.5(BAT)
VBKP: BT1.1(+3V)
VCC1: C27.2 C28.2 C29.2 C30.2 C32.2 FB2.1 IC5.5(VOUT) R15.1 R16.1 R28.2
VCC1A: FB2.2
VCC2: C19.2 C20.2 C21.2 C22.2 C24.2 FB1.1 IC4.5(VOUT) R29.2
VCC2A: FB1.2
VCHRG: C17.2 DIO3.1(A) R21.1 R27.2 U3.4(VCC) U3.8(CE)
A0: C16.2 R11.2 R17.2 ; port VBUTTON
A1: C26.2 R22.1 R25.2 ; port VADCB
A2: C25.2 R21.2 R24.1 ; port VCHRG
C1: R13.2 ; port PCTRL0
C2: IC4.3(EN) R23.2 ; port PCTRL1
CHRG: R16.2 U3.7(CHRG) ; port VCHRGL  [project net A3]
STDBY: R15.2 U3.6(STDBY) ; port VSTDBY  [project net A4]
NetC14_1: C14.1 IC2.5(GND) IC2.7(GND) IC2.8(GND) JP2.1
NetC14_2: C14.2 IC2.6(VDD) R9.2
NetC18_1: C18.1 R14.2
NetDIO1_1: DIO1.1(A) R12.2
NetDIO1_2: DIO1.2(K) DIO2.2(K) Q3.1(B) R19.1
NetDIO2_1: DIO2.1(A) R13.1
NetIC3_1: IC3.1(G) Q3.3(C) R10.2
NetIC5_3: IC5.3(EN) R26.2
NetLED3_1: LED3.1 R27.1
NetLED4_1: LED4.1 R28.1
NetLED5_1: LED5.1 R29.1
NetR11_1: R11.1 R12.1 R14.1 R18.1 SW4.1
NetR20_2: R20.2 U3.2(PROG)

Not connected (* = marked no-connect by the designer): IC4 4(NC)*; IC5 4(NC)*

### Notes on the sheet
- LiPo battery single cell (3.7-4.2V)
- DWG. NO.
- REV.
- SHT.
- THIS DOCUMENT AND THE DATA DISCLOSED HEREIN OR HEREWITH IS THE PROPERTY OF ALTIUM LIMITED AND MAY BE FREELY DISTRIBUTED IN WHOLE. NO RIGHTS ARE RESERVED OR EXPRESS OR IMPLIED WARANTEE GIVEN.
- REVISION
- DESCRIPTION
- DATE
- APPROVED
- ENG:
- APPROVALS
- PROJECT
- DSN:
- CHK:
- REFERENCE DOCUMENTS
- PROJECT REVISION:
- TITLE
- DOCUMENT REVISION:
- DESIGN ITEM:
- BOM:
- FAB DWG:
- PCB DWG:
- ASSY DWG:
- SCALE:
- SIZE
- B
- CAGE CODE
- FILE NAME
- DWG NO.
- SHEET
- OF
- REV
- (in symbol PIN 3V) +; -

### Library data of the parts
BT1 = PIN 3V: Battery 3VDC; Value: PIN 3V
C14-C17 C19-C32 = CapSMD: Capacitor; Value: 33p; Published: 8-Jun-2000; LatestRevisionDate: 17-Jul-2002; LatestRevisionNote: Re-released for DXP Platform.; PackageReference: RAD-0.3; Publisher: Altium Limited
C18 = Cap Pol: Polarized Capacitor (Axial); Published: 8-Jun-2000; LatestRevisionDate: 17-Jul-2002; LatestRevisionNote: Re-released for DXP Platform.; PackageReference: POLAR0.8; Publisher: Altium Limited
DIO1-DIO3 = Diode SMD: Default Diode; Code - JEDEC: DO-214-AB; Value: 1N5007; Published: 8-Jun-2000; Revision: July-2002: Re-released for DXP Platform.; Publisher: Altium Limited
FB1 FB2 = Ferrit Bead: Generic Ferrit Bead
IC2 = XB8688: One Cell Lithium-ion/Polymer Battery Protection IC
IC3 = MOSFET_P: Generic P Channel MOSFET
IC4 IC5 = RT9013: RT9013-33GB IC REG LINEAR 3.3V 500mA SOT23-5
JP2 = Con2: Connector 2; Value: Connector 2
LED3-LED5 = LED: as LED1 on sheet MCUs
Q3 = C1815: NPN 600mW, ECB; Value: C1815
R9-R29 = Resistor - SMD: as R1 on sheet MCUs; Published: 08/06/2000; Publisher: Altium Hobart Technology Centre
SW4 = SW2: as SW1 on sheet MCUs
U3 = TP4056: Complete single cell Li-Ion battery with a constant current / constant voltage linear charger

## Sheet Sensor.SchDoc
size B; Organization: ORGANIZATION; Address1: ADDRESS 1; Address2: ADDRESS 2; Address3: ADDRESS 3; Address4: ADDRESS 4; Revision: -; SheetNumber: 5; SheetTotal: 7; ENG_APP_DATE: --/--/--; DSN_APP_DATE: --/--/--; CHK_APP_DATE: --/--/--
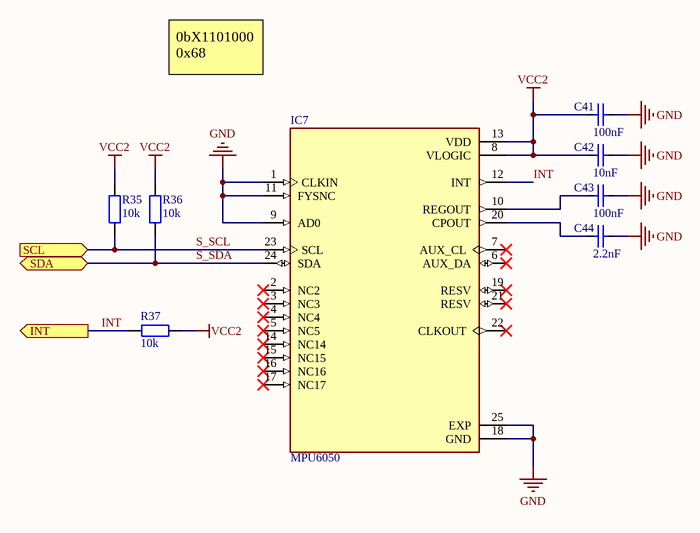
[diagram p5: Sensor.SchDoc]

### Parts
C41  100nF  [CAP_0603]
C42  10nF  [CAP_0603]
C43  100nF  [CAP_0603]
C44  2.2nF  [CAP_0603]
IC7  MPU6050  [QFN24]
R35  10k  [RES-SMD-0603]
R36  10k  [RES-SMD-0603]
R37  10k  [RES-SMD-0603]

### Ports
INT (out), SCL (in), SDA (bidir)

### Nets
GND: C41.1 C42.1 C43.1 C44.1 IC7.1(CLKIN) IC7.9(AD0) IC7.11(FYSNC) IC7.18(GND) IC7.25(EXP)
VCC2: C41.2 C42.2 IC7.8(VLOGIC) IC7.13(VDD) R35.2 R36.2 R37.1
INT: IC7.12(INT) R37.2 ; port INT
S_SCL: IC7.23(SCL) R35.1 ; port SCL
S_SDA: IC7.24(SDA) R36.1 ; port SDA
NetC43_2: C43.2 IC7.10(REGOUT)
NetC44_2: C44.2 IC7.20(CPOUT)

Not connected (* = marked no-connect by the designer): IC7 2(NC2)* 3(NC3)* 4(NC4)* 5(NC5)* 6(AUX_DA)* 7(AUX_CL)* 14(NC14)* 15(NC15)* 16(NC16)* 17(NC17)* 19(RESV)* 21(RESV)* 22(CLKOUT)*

### Notes on the sheet
- 0bX1101000
  0x68
- DWG. NO.
- REV.
- SHT.
- THIS DOCUMENT AND THE DATA DISCLOSED HEREIN OR HEREWITH IS THE PROPERTY OF ALTIUM LIMITED AND MAY BE FREELY DISTRIBUTED IN WHOLE. NO RIGHTS ARE RESERVED OR EXPRESS OR IMPLIED WARANTEE GIVEN.
- REVISION
- DESCRIPTION
- DATE
- APPROVED
- ENG:
- APPROVALS
- PROJECT
- DSN:
- CHK:
- REFERENCE DOCUMENTS
- PROJECT REVISION:
- TITLE
- DOCUMENT REVISION:
- DESIGN ITEM:
- BOM:
- FAB DWG:
- PCB DWG:
- ASSY DWG:
- SCALE:
- SIZE
- B
- CAGE CODE
- FILE NAME
- DWG NO.
- SHEET
- OF
- REV

### Library data of the parts
C41-C44 = CapSMD: Capacitor; Value: 33p; Published: 8-Jun-2000; LatestRevisionDate: 17-Jul-2002; LatestRevisionNote: Re-released for DXP Platform.; PackageReference: RAD-0.3; Publisher: Altium Limited
IC7 = MPU6050_Chip: 3-axis gyroscope, 3-axis accelerometer
R35-R37 = Resistor - SMD: as R1 on sheet MCUs; Published: 08/06/2000; Publisher: Altium Hobart Technology Centre

## Sheet LCD.SchDoc
size B; SheetNumber: 7; SheetTotal: 7
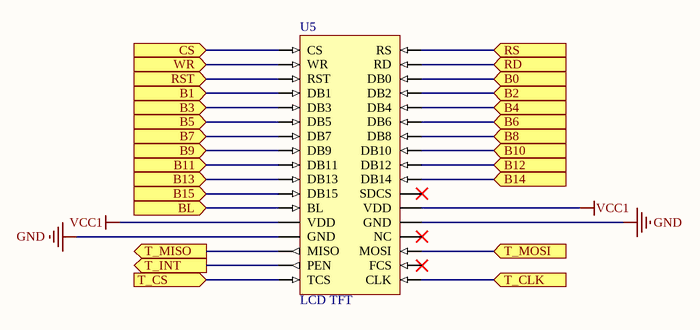
[diagram p6: LCD.SchDoc]

### Parts
U5  LCD TFT  [LCD TFT 2.8" Parallel 8/16-bit]

### Ports
B0 (in), B1 (in), B2 (in), B3 (in), B4 (in), B5 (in), B6 (in), B7 (in), B8 (in), B9 (in), B10 (in), B11 (in), B12 (in), B13 (in), B14 (in), B15 (in), BL (in), CS (in), RD (in), RS (in), RST (in), T_CLK (in), T_CS (in), T_INT (out), T_MISO (out), T_MOSI (in), WR (in)

### Nets
GND: U5.14(GND) U5.22(GND)
VCC1: U5.13(VDD) U5.23(VDD)
A5: U5.18(CLK) ; port T_CLK
A6: U5.15(MISO) ; port T_MISO
A7: U5.20(MOSI) ; port T_MOSI
A8: U5.33(RD) ; port RD
A9: U5.3(RST) ; port RST
B0: U5.32(DB0) ; port B0
B1: U5.4(DB1) ; port B1
B2: U5.31(DB2) ; port B2
B3: U5.5(DB3) ; port B3
B4: U5.30(DB4) ; port B4
B5: U5.6(DB5) ; port B5
B6: U5.29(DB6) ; port B6
B7: U5.7(DB7) ; port B7
B8: U5.28(DB8) ; port B8
B9: U5.8(DB9) ; port B9
B10: U5.27(DB10) ; port B10
B11: U5.9(DB11) ; port B11
B12: U5.26(DB12) ; port B12
B13: U5.10(DB13) ; port B13
B14: U5.25(DB14) ; port B14
B15: U5.11(DB15) ; port B15
C4: U5.17(TCS) ; port T_CS
C5: U5.16(PEN) ; port T_INT
C6: U5.12(BL) ; port BL
C7: U5.1(CS) ; port CS
C8: U5.34(RS) ; port RS
C9: U5.2(WR) ; port WR

Not connected (* = marked no-connect by the designer): U5 19(FCS)* 21(NC)* 24(SDCS)*

### Notes on the sheet
- DWG. NO.
- REV.
- SHT.
- THIS DOCUMENT AND THE DATA DISCLOSED HEREIN OR HEREWITH IS THE PROPERTY OF ALTIUM LIMITED AND MAY BE FREELY DISTRIBUTED IN WHOLE. NO RIGHTS ARE RESERVED OR EXPRESS OR IMPLIED WARANTEE GIVEN.
- REVISION
- DESCRIPTION
- DATE
- APPROVED
- ENG:
- APPROVALS
- PROJECT
- DSN:
- CHK:
- REFERENCE DOCUMENTS
- PROJECT REVISION:
- TITLE
- DOCUMENT REVISION:
- DESIGN ITEM:
- BOM:
- FAB DWG:
- PCB DWG:
- ASSY DWG:
- SCALE:
- SIZE
- B
- CAGE CODE
- FILE NAME
- DWG NO.
- SHEET
- OF
- REV

### Library data of the parts
U5 = LCD TFT 16-bit

## Nets that join several sheets
GND: MCUs (49 pins), Audio (22 pins), GPS (11 pins), Power (39 pins), Sensor (9 pins), LCD (U5.14 U5.22)
VBKP: MCUs (U1.1), GPS (IC8.6), Power (BT1.1)
VCC1: MCUs (12 pins), Power (10 pins), LCD (U5.13 U5.23)
VCC1A: MCUs (U1.13), Power (FB2.2)
VCC2: MCUs (7 pins), Audio (6 pins), GPS (IC8.8 R38.1 R39.1), Power (8 pins), Sensor (7 pins)
VCC2A: Audio (IC6.8), Power (FB1.2)
VCHRG: MCUs (J2.1), Power (6 pins)
1PPS: MCUs (U1.11), GPS (IC8.4 R40.2)
A0: MCUs (U1.14), Power (C16.2 R11.2 R17.2)
A1: MCUs (U1.15), Power (C26.2 R22.1 R25.2)
A2: MCUs (U1.16), Power (C25.2 R21.2 R24.1)
A3: MCUs (U1.17), Power (R16.2 U3.7)
A4: MCUs (U1.20), Power (R15.2 U3.6)
A5: MCUs (U1.21), LCD (U5.18)
A6: MCUs (U1.22), LCD (U5.15)
A7: MCUs (U1.23), LCD (U5.20)
A8: MCUs (U1.41), LCD (U5.33)
A9: MCUs (U1.42), LCD (U5.3)
B0: MCUs (U1.26), LCD (U5.32)
B1: MCUs (U1.28), LCD (U5.4)
B2: MCUs (U1.27), LCD (U5.31)
B3: MCUs (U1.55), LCD (U5.5)
B4: MCUs (U1.56), LCD (U5.30)
B5: MCUs (U1.57), LCD (U5.6)
B6: MCUs (U1.58), LCD (U5.29)
B7: MCUs (U1.59), LCD (U5.7)
B8: MCUs (U1.61), LCD (U5.28)
B9: MCUs (U1.62), LCD (U5.8)
B10: MCUs (U1.29), LCD (U5.27)
B11: MCUs (U1.30), LCD (U5.9)
B12: MCUs (U1.33), LCD (U5.26)
B13: MCUs (U1.34), LCD (U5.10)
B14: MCUs (U1.35), LCD (U5.25)
B15: MCUs (U1.36), LCD (U5.11)
BCK: MCUs (IC1.10), Audio (IC6.13)
C1: MCUs (U1.9), Power (R13.2)
C2: MCUs (U1.10), Power (IC4.3 R23.2)
C4: MCUs (U1.24), LCD (U5.17)
C5: MCUs (U1.25), LCD (U5.16)
C6: MCUs (U1.37), LCD (U5.12)
C7: MCUs (U1.38), LCD (U5.1)
C8: MCUs (U1.39), LCD (U5.34)
C9: MCUs (U1.40), LCD (U5.2)
DIN: MCUs (IC1.12), Audio (IC6.14)
GPS_RX: MCUs (IC1.8), GPS (IC8.3)
GPS_TX: MCUs (IC1.9), GPS (IC8.2)
INT: MCUs (IC1.6), Sensor (IC7.12 R37.2)
LRCK: MCUs (IC1.11), Audio (IC6.15)
NetIC1_26: MCUs (IC1.26), GPS (R41.2)
S_SCL: MCUs (IC1.36), Sensor (IC7.23 R35.1)
S_SDA: MCUs (IC1.33), Sensor (IC7.24 R36.1)
SCK: MCUs (IC1.13), Audio (IC6.12 R30.2)
SD_CS: MCUs (IC1.29), Audio (U4.2)
SD_MISO: MCUs (IC1.31), Audio (U4.7)
SD_MOSI: MCUs (IC1.37), Audio (U4.3)
SD_SCLK: MCUs (IC1.30), Audio (U4.5)
XSMT: MCUs (IC1.14), Audio (C38.1 IC6.17 R33.2 R34.1)